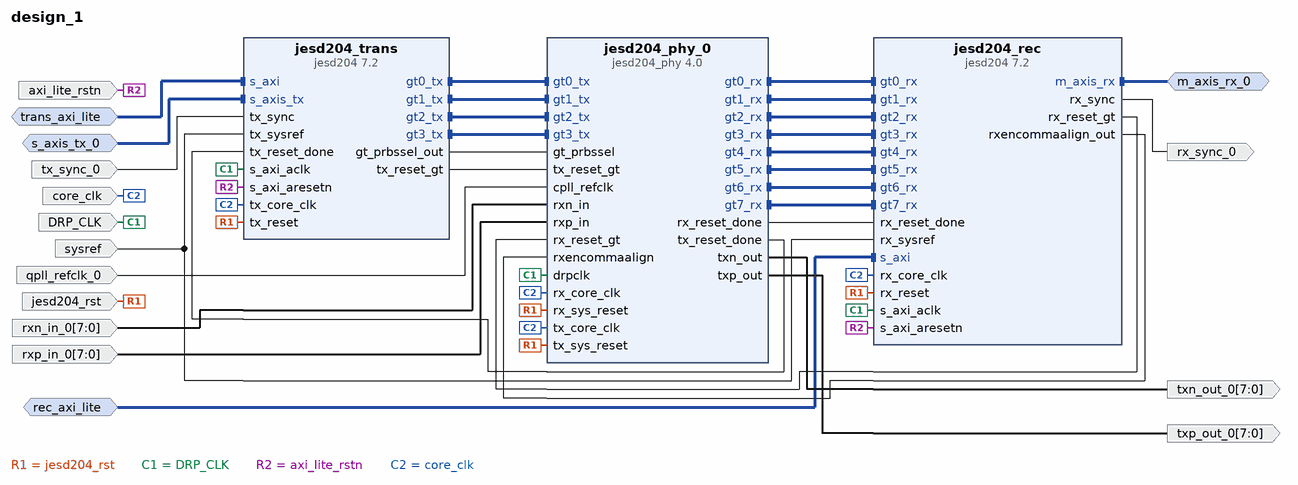
[diagram p0: block diagram of the top level]
# Vivado block design design_1, xc7k325tffg900-2, Vivado 2022.2
create_bd_design design_1

create_bd_intf_port -mode Slave -vlnv xilinx.com:interface:aximm_rtl:1.0 trans_axi_lite
set_property -dict [list \
  CONFIG.ADDR_WIDTH 12 \
  CONFIG.ARUSER_WIDTH 0 \
  CONFIG.AWUSER_WIDTH 0 \
  CONFIG.BUSER_WIDTH 0 \
  CONFIG.DATA_WIDTH 32 \
  CONFIG.HAS_BRESP 1 \
  CONFIG.HAS_BURST 0 \
  CONFIG.HAS_CACHE 0 \
  CONFIG.HAS_LOCK 0 \
  CONFIG.HAS_PROT 0 \
  CONFIG.HAS_QOS 0 \
  CONFIG.HAS_REGION 0 \
  CONFIG.HAS_RRESP 1 \
  CONFIG.HAS_WSTRB 1 \
  CONFIG.ID_WIDTH 0 \
  CONFIG.MAX_BURST_LENGTH 1 \
  CONFIG.NUM_READ_OUTSTANDING 1 \
  CONFIG.NUM_READ_THREADS 1 \
  CONFIG.NUM_WRITE_OUTSTANDING 1 \
  CONFIG.NUM_WRITE_THREADS 1 \
  CONFIG.PROTOCOL AXI4LITE \
  CONFIG.READ_WRITE_MODE READ_WRITE \
  CONFIG.RUSER_BITS_PER_BYTE 0 \
  CONFIG.RUSER_WIDTH 0 \
  CONFIG.SUPPORTS_NARROW_BURST 0 \
  CONFIG.WUSER_BITS_PER_BYTE 0 \
  CONFIG.WUSER_WIDTH 0 \
] [get_bd_intf_ports trans_axi_lite]
create_bd_intf_port -mode Slave -vlnv xilinx.com:interface:aximm_rtl:1.0 rec_axi_lite
set_property -dict [list \
  CONFIG.ADDR_WIDTH 12 \
  CONFIG.ARUSER_WIDTH 0 \
  CONFIG.AWUSER_WIDTH 0 \
  CONFIG.BUSER_WIDTH 0 \
  CONFIG.DATA_WIDTH 32 \
  CONFIG.HAS_BRESP 1 \
  CONFIG.HAS_BURST 0 \
  CONFIG.HAS_CACHE 0 \
  CONFIG.HAS_LOCK 0 \
  CONFIG.HAS_PROT 0 \
  CONFIG.HAS_QOS 0 \
  CONFIG.HAS_REGION 0 \
  CONFIG.HAS_RRESP 1 \
  CONFIG.HAS_WSTRB 1 \
  CONFIG.ID_WIDTH 0 \
  CONFIG.MAX_BURST_LENGTH 1 \
  CONFIG.NUM_READ_OUTSTANDING 1 \
  CONFIG.NUM_READ_THREADS 1 \
  CONFIG.NUM_WRITE_OUTSTANDING 1 \
  CONFIG.NUM_WRITE_THREADS 1 \
  CONFIG.PROTOCOL AXI4LITE \
  CONFIG.READ_WRITE_MODE READ_WRITE \
  CONFIG.RUSER_BITS_PER_BYTE 0 \
  CONFIG.RUSER_WIDTH 0 \
  CONFIG.SUPPORTS_NARROW_BURST 0 \
  CONFIG.WUSER_BITS_PER_BYTE 0 \
  CONFIG.WUSER_WIDTH 0 \
] [get_bd_intf_ports rec_axi_lite]
create_bd_intf_port -mode Slave -vlnv xilinx.com:interface:axis_rtl:1.0 s_axis_tx_0
set_property -dict [list \
  CONFIG.FREQ_HZ 245760000 \
  CONFIG.HAS_TKEEP 0 \
  CONFIG.HAS_TLAST 0 \
  CONFIG.HAS_TREADY 1 \
  CONFIG.HAS_TSTRB 0 \
  CONFIG.LAYERED_METADATA undef \
  CONFIG.TDATA_NUM_BYTES 16 \
  CONFIG.TDEST_WIDTH 0 \
  CONFIG.TID_WIDTH 0 \
  CONFIG.TUSER_WIDTH 0 \
] [get_bd_intf_ports s_axis_tx_0]
create_bd_intf_port -mode Master -vlnv xilinx.com:interface:axis_rtl:1.0 m_axis_rx_0
set_property -dict {CONFIG.FREQ_HZ 245760000} [get_bd_intf_ports m_axis_rx_0]
create_bd_port -dir I -type clk DRP_CLK
create_bd_port -dir O rx_sync_0
create_bd_port -dir I jesd204_rst
create_bd_port -dir I sysref
create_bd_port -dir I tx_sync_0
create_bd_port -dir I -type clk qpll_refclk_0
create_bd_port -dir I -type rst axi_lite_rstn
create_bd_port -dir I -type clk core_clk
set_property -dict {CONFIG.ASSOCIATED_BUSIF s_axis_tx_0:m_axis_rx_0 CONFIG.FREQ_HZ 245760000} [get_bd_ports core_clk]
create_bd_port -dir O -from 7 -to 0 txp_out_0
create_bd_port -dir O -from 7 -to 0 txn_out_0
create_bd_port -dir I -from 7 -to 0 rxp_in_0
create_bd_port -dir I -from 7 -to 0 rxn_in_0

create_bd_cell -type ip -vlnv xilinx.com:ip:jesd204:7.2 jesd204_trans
set_property -dict [list \
  CONFIG.C_DEFAULT_F 4 \
  CONFIG.C_DEFAULT_SCR 0 \
  CONFIG.C_LANES 4 \
  CONFIG.C_PLL_SELECTION 3 \
  CONFIG.GT_Line_Rate 9.8304 \
  CONFIG.GT_REFCLK_FREQ 122.880 \
  CONFIG.SupportLevel 0 \
] [get_bd_cells jesd204_trans]
create_bd_cell -type ip -vlnv xilinx.com:ip:jesd204:7.2 jesd204_rec
set_property -dict [list \
  CONFIG.AXICLK_FREQ 120 \
  CONFIG.C_DEFAULT_F 4 \
  CONFIG.C_DEFAULT_K 8 \
  CONFIG.C_DEFAULT_SCR 0 \
  CONFIG.C_DEFAULT_SYSREF_ALWAYS 0 \
  CONFIG.C_DEFAULT_SYSREF_REQUIRED 0 \
  CONFIG.C_LANES 8 \
  CONFIG.C_NODE_IS_TRANSMIT 0 \
  CONFIG.C_PLL_SELECTION 3 \
  CONFIG.C_SYSREF_SAMPLING_EDGE 1 \
  CONFIG.GT_Line_Rate 9.8304 \
  CONFIG.GT_REFCLK_FREQ 122.880 \
  CONFIG.SupportLevel 0 \
] [get_bd_cells jesd204_rec]
create_bd_cell -type ip -vlnv xilinx.com:ip:jesd204_phy:4.0 jesd204_phy_0
set_property -dict [list \
  CONFIG.C_LANES 8 \
  CONFIG.C_PLL_SELECTION 0 \
  CONFIG.GT_Line_Rate 4.8 \
  CONFIG.GT_REFCLK_FREQ 120.000 \
  CONFIG.RX_GT_Line_Rate 4.8 \
  CONFIG.RX_GT_REFCLK_FREQ 120.000 \
  CONFIG.RX_PLL_SELECTION 0 \
] [get_bd_cells jesd204_phy_0]

# ---- connections ----

connect_bd_intf_net [get_bd_intf_pins jesd204_phy_0/gt0_rx] [get_bd_intf_pins jesd204_rec/gt0_rx]
connect_bd_intf_net [get_bd_intf_pins jesd204_phy_0/gt1_rx] [get_bd_intf_pins jesd204_rec/gt1_rx]
connect_bd_intf_net [get_bd_intf_pins jesd204_phy_0/gt2_rx] [get_bd_intf_pins jesd204_rec/gt2_rx]
connect_bd_intf_net [get_bd_intf_pins jesd204_phy_0/gt3_rx] [get_bd_intf_pins jesd204_rec/gt3_rx]
connect_bd_intf_net [get_bd_intf_pins jesd204_phy_0/gt4_rx] [get_bd_intf_pins jesd204_rec/gt4_rx]
connect_bd_intf_net [get_bd_intf_pins jesd204_phy_0/gt5_rx] [get_bd_intf_pins jesd204_rec/gt5_rx]
connect_bd_intf_net [get_bd_intf_pins jesd204_phy_0/gt6_rx] [get_bd_intf_pins jesd204_rec/gt6_rx]
connect_bd_intf_net [get_bd_intf_pins jesd204_phy_0/gt7_rx] [get_bd_intf_pins jesd204_rec/gt7_rx]
connect_bd_intf_net [get_bd_intf_ports m_axis_rx_0] [get_bd_intf_pins jesd204_rec/m_axis_rx]
connect_bd_intf_net [get_bd_intf_pins jesd204_trans/gt0_tx] [get_bd_intf_pins jesd204_phy_0/gt0_tx]
connect_bd_intf_net [get_bd_intf_pins jesd204_trans/gt1_tx] [get_bd_intf_pins jesd204_phy_0/gt1_tx]
connect_bd_intf_net [get_bd_intf_pins jesd204_trans/gt2_tx] [get_bd_intf_pins jesd204_phy_0/gt2_tx]
connect_bd_intf_net [get_bd_intf_pins jesd204_trans/gt3_tx] [get_bd_intf_pins jesd204_phy_0/gt3_tx]
connect_bd_intf_net -intf_net s_axi_0_1 [get_bd_intf_ports trans_axi_lite] [get_bd_intf_pins jesd204_trans/s_axi]
connect_bd_intf_net -intf_net s_axi_0_2 [get_bd_intf_ports rec_axi_lite] [get_bd_intf_pins jesd204_rec/s_axi]
connect_bd_intf_net -intf_net s_axis_tx_0_1 [get_bd_intf_ports s_axis_tx_0] [get_bd_intf_pins jesd204_trans/s_axis_tx]
connect_bd_net [get_bd_pins jesd204_phy_0/rx_reset_done] [get_bd_pins jesd204_rec/rx_reset_done]
connect_bd_net [get_bd_pins jesd204_phy_0/tx_reset_done] [get_bd_pins jesd204_trans/tx_reset_done]
connect_bd_net [get_bd_pins jesd204_phy_0/txn_out] [get_bd_ports txn_out_0]
connect_bd_net [get_bd_pins jesd204_phy_0/txp_out] [get_bd_ports txp_out_0]
connect_bd_net [get_bd_pins jesd204_rec/rx_reset_gt] [get_bd_pins jesd204_phy_0/rx_reset_gt]
connect_bd_net [get_bd_pins jesd204_rec/rx_sync] [get_bd_ports rx_sync_0]
connect_bd_net [get_bd_pins jesd204_rec/rxencommaalign_out] [get_bd_pins jesd204_phy_0/rxencommaalign]
connect_bd_net [get_bd_pins jesd204_trans/gt_prbssel_out] [get_bd_pins jesd204_phy_0/gt_prbssel]
connect_bd_net [get_bd_pins jesd204_trans/tx_reset_gt] [get_bd_pins jesd204_phy_0/tx_reset_gt]
connect_bd_net -net qpll_refclk_0_1 [get_bd_ports qpll_refclk_0] [get_bd_pins jesd204_phy_0/cpll_refclk]
connect_bd_net -net rx_reset_0_1 [get_bd_ports jesd204_rst] \
  [get_bd_pins jesd204_trans/tx_reset] [get_bd_pins jesd204_rec/rx_reset] [get_bd_pins jesd204_phy_0/tx_sys_reset] \
  [get_bd_pins jesd204_phy_0/rx_sys_reset]
connect_bd_net -net rx_sysref_0_1 [get_bd_ports sysref] [get_bd_pins jesd204_trans/tx_sysref] [get_bd_pins jesd204_rec/rx_sysref]
connect_bd_net -net rxn_in_0_1 [get_bd_ports rxn_in_0] [get_bd_pins jesd204_phy_0/rxn_in]
connect_bd_net -net rxp_in_0_1 [get_bd_ports rxp_in_0] [get_bd_pins jesd204_phy_0/rxp_in]
connect_bd_net -net s_axi_aclk_0_1 [get_bd_ports DRP_CLK] \
  [get_bd_pins jesd204_trans/s_axi_aclk] [get_bd_pins jesd204_rec/s_axi_aclk] [get_bd_pins jesd204_phy_0/drpclk]
connect_bd_net -net s_axi_aresetn_0_1 [get_bd_ports axi_lite_rstn] [get_bd_pins jesd204_trans/s_axi_aresetn] [get_bd_pins jesd204_rec/s_axi_aresetn]
connect_bd_net -net tx_core_clk_1_1 [get_bd_ports core_clk] \
  [get_bd_pins jesd204_trans/tx_core_clk] [get_bd_pins jesd204_rec/rx_core_clk] [get_bd_pins jesd204_phy_0/tx_core_clk] \
  [get_bd_pins jesd204_phy_0/rx_core_clk]
connect_bd_net -net tx_sync_0_1 [get_bd_ports tx_sync_0] [get_bd_pins jesd204_trans/tx_sync]

# ---- address map ----
assign_bd_address -offset 0x000 -range 4K -target_address_space [get_bd_addr_spaces rec_axi_lite] [get_bd_addr_segs jesd204_rec/s_axi/Reg]
assign_bd_address -offset 0x000 -range 4K -target_address_space [get_bd_addr_spaces trans_axi_lite] [get_bd_addr_segs jesd204_trans/s_axi/Reg]

validate_bd_design
save_bd_design
